# Altium project pisique.PrjPCB
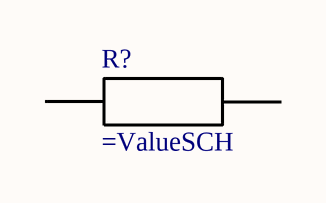
[diagram p0: main.SchDoc]
1 sheet, 1 parts. Net scope: global (net labels, ports and power ports of the same name join across sheets).
Board file: PCB.PcbDoc

## Sheet main.SchDoc
size A4

### Parts
R?  (no value)  [R0402]

### Nets

Not connected (* = marked no-connect by the designer): R? 1 2

### Library data of the parts
R? = 200R: RESISTOR GOST; Part Number: 200R; Manufacturer: Yageo; ManufacturerPartNumber: -----------; Tolerance: 1%; Value: 200R; Digi-Key Part Number: YAG3453CT-ND; Package: 0402